# EAGLE schematic OBUF (EAGLE 8.4.1)
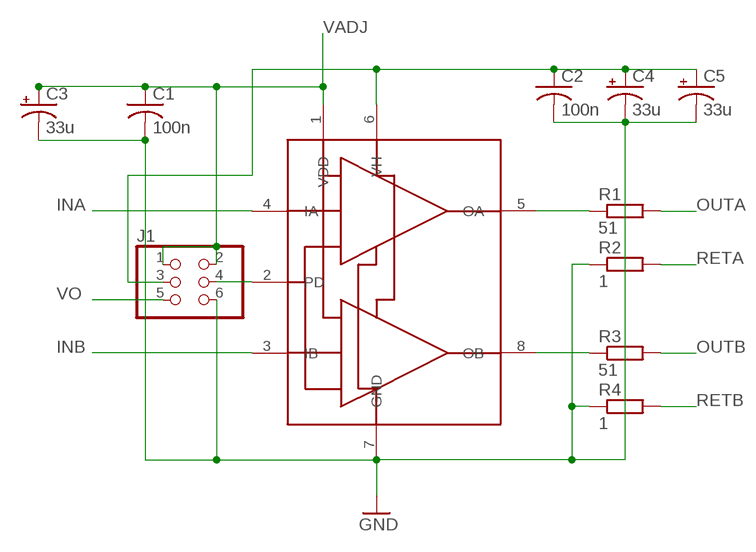
[diagram p0: schematic, sheet 1]

## Parts
C1  100n  C-USC2012  [C2012]
C2  100n  C-USC2012  [C2012]
C3  33u  CPOL-USB/3528-21R  [B/3528-21R]
C4  33u  CPOL-USB/3528-21R  [B/3528-21R]
C5  33u  CPOL-USB/3528-21R  [B/3528-21R]
J1  PINHD-2X3  [2X03]
R1  51  R-EU_R0805  [R0805]
R2  1  R-EU_R0805  [R0805]
R3  51  R-EU_R0805  [R0805]
R4  1  R-EU_R0805  [R0805]
U$1  ISL55110  [TSSOP8]

## Nets
GND: C1.2 C2.2 C3.- C4.- C5.- J1.6 R2.1 R4.1 U$1.7(GND)
INA: U$1.4(IA)
INB: U$1.3(IB)
N$1: C2.1 C4.+ C5.+ J1.3 U$1.6(VH)
N$2: R3.1 U$1.8(OB)
N$3: R1.1 U$1.5(OA)
N$5: J1.4 U$1.2(PD)
OUTA: R1.2
OUTB: R3.2
RETA: R2.2
RETB: R4.2
VADJ: C1.1 C3.+ J1.1 J1.2 U$1.1(VDD)
VO: J1.5

## Library data of the parts
C1 C2 = adafruit:C-US: CAPACITOR, American symbol
C3-C5 = adafruit:CPOL-US: POLARIZED CAPACITOR, American symbol
J1 = SparkFun-Retired:PINHD-2X3: PIN HEADER
R1-R4 = rcl:R-EU_: RESISTOR, European symbol
U$1 = ISL55110:ISL55110